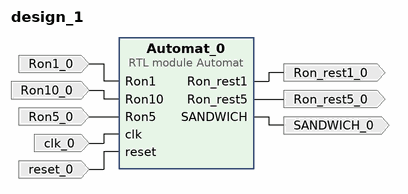
[diagram p0: block diagram of the top level]
# Vivado block design design_1, xc7a100tcsg324-1, Vivado 2020.2
create_bd_design design_1

create_bd_port -dir I Ron1_0
create_bd_port -dir I Ron10_0
create_bd_port -dir I Ron5_0
create_bd_port -dir O Ron_rest1_0
create_bd_port -dir O Ron_rest5_0
create_bd_port -dir O SANDWICH_0
create_bd_port -dir I -type clk clk_0
create_bd_port -dir I -type rst reset_0

create_bd_cell -type module -reference Automat Automat_0

# ---- connections ----

connect_bd_net -net Ron1_0_1 [get_bd_ports Ron1_0] [get_bd_pins Automat_0/Ron1]
connect_bd_net -net Ron10_0_1 [get_bd_ports Ron10_0] [get_bd_pins Automat_0/Ron10]
connect_bd_net -net Ron5_0_1 [get_bd_ports Ron5_0] [get_bd_pins Automat_0/Ron5]
connect_bd_net [get_bd_pins Automat_0/Ron_rest1] [get_bd_ports Ron_rest1_0]
connect_bd_net [get_bd_pins Automat_0/Ron_rest5] [get_bd_ports Ron_rest5_0]
connect_bd_net [get_bd_pins Automat_0/SANDWICH] [get_bd_ports SANDWICH_0]
connect_bd_net -net clk_0_1 [get_bd_ports clk_0] [get_bd_pins Automat_0/clk]
connect_bd_net -net reset_0_1 [get_bd_ports reset_0] [get_bd_pins Automat_0/reset]

validate_bd_design
save_bd_design
